# EAGLE schematic RTC (EAGLE 9.6.1)
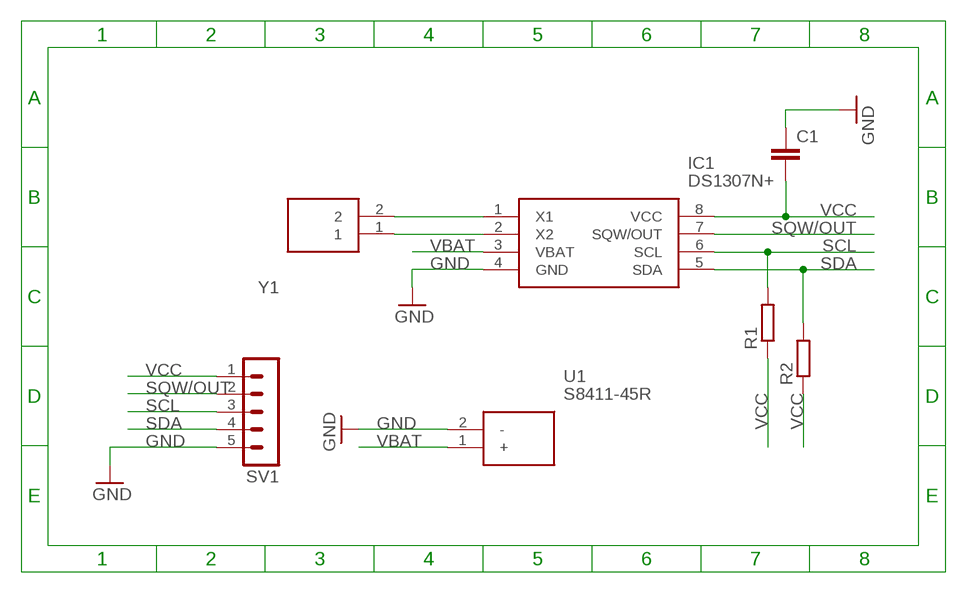
[diagram p0: schematic, sheet 1]

## Parts
C1  C-EUC0805  [C0805]
IC1  DS1307N+  [DIP762W56P254L938H457Q8N]
R1  R-EU_M1206  [M1206]
R2  R-EU_M1206  [M1206]
SV1  MA05-1  [MA05-1]
U1  S8411-45R  [S8411-45R_1]
Y1  CM7V-T1A-32.768K-9PF-20PPM-TA-  [CM7VT1A32768KHZ125PF10PPMTBQC]

## Nets
GND: C1.1 IC1.4(GND) SV1.5 U1.2(-)
N$1: IC1.1(X1) Y1.2
N$2: IC1.2(X2) Y1.1
SCL: IC1.6(SCL) R1.2 SV1.3
SDA: IC1.5(SDA) R2.2 SV1.4
SQW/OUT: IC1.7(SQW/OUT) SV1.2
VBAT: IC1.3(VBAT) U1.1(+)
VCC: C1.2 IC1.8(VCC) R1.1 R2.1 SV1.1

## Library data of the parts
C1 = rcl:C-EU: CAPACITOR, European symbol; SPICEPREFIX: C
IC1 = MouserUseful:DS1307N+: 64 x 8, Serial, I2C Real-Time Clock Source: Datasheet; DESCRIPTION: 64 x 8, Serial, I2C Real-Time Clock; HEIGHT: 4.572mm; MANUFACTURER_NAME: Maxim Integrated; MANUFACTURER_PART_NUMBER: DS1307N+; MOUSER_PART_NUMBER: 700-DS1307N; MOUSER_PRICE-STOCK: https://www.mouser.co.uk/ProductDetail/Maxim-Integrated/DS1307N%2b?qs=0Y9aZN%252BMVCUaDyAv0LKbtw%3D%3D
R1 R2 = rcl:R-EU_: RESISTOR, European symbol; SPICEPREFIX: R
SV1 = con-lstb:MA05-1: PIN HEADER; OC_FARNELL: unknown; OC_NEWARK: unknown
U1 = MouserUseful:S8411-45R: HARWIN - S8411-45R - HOLDER, COIN CELL, CR1220, FULL REEL Source: Datasheet <https://cdn.harwin.com/pdfs/S8411R.pdf>; DESCRIPTION: HARWIN - S8411-45R - HOLDER, COIN CELL, CR1220, FULL REEL; HEIGHT: mm; MANUFACTURER_NAME: HARWIN; MANUFACTURER_PART_NUMBER: S8411-45R; MOUSER_PART_NUMBER: 855-S8411-45R; MOUSER_PRICE-STOCK: https://www.mouser.co.uk/ProductDetail/Harwin/S8411-45R?qs=Qom7kyPojXY6B0JhnWxDgQ%3D%3D
Y1 = MouserUseful:CM7V-T1A-32.768K-9PF-20PPM-TA-: Crystals 32.768 kHz 9.0 pF +/-20 PPM AEC-Q200 Source: Datasheet <https://componentsearchengine.com/Datasheets/1/CM7V-T1A-32.768k-9pF-20PPM-TA-QA T3.pdf>; DESCRIPTION: Crystals 32.768 kHz 9.0 pF +/-20 PPM AEC-Q200; HEIGHT: 0.65mm; MANUFACTURER_NAME: MICRO CRYSTAL; MANUFACTURER_PART_NUMBER: CM7V-T1A-32.768k-9pF-20PPM-TA-QA T3; MOUSER_PART_NUMBER: 428-201568-MG03; MOUSER_PRICE-STOCK: https://www.mouser.com/Search/Refine.aspx?Keyword=428-201568-MG03